# Altium schematic sheet comparators.SchDoc
size 508 x 241 mm; SheetNumber: 1; SheetTotal: 4
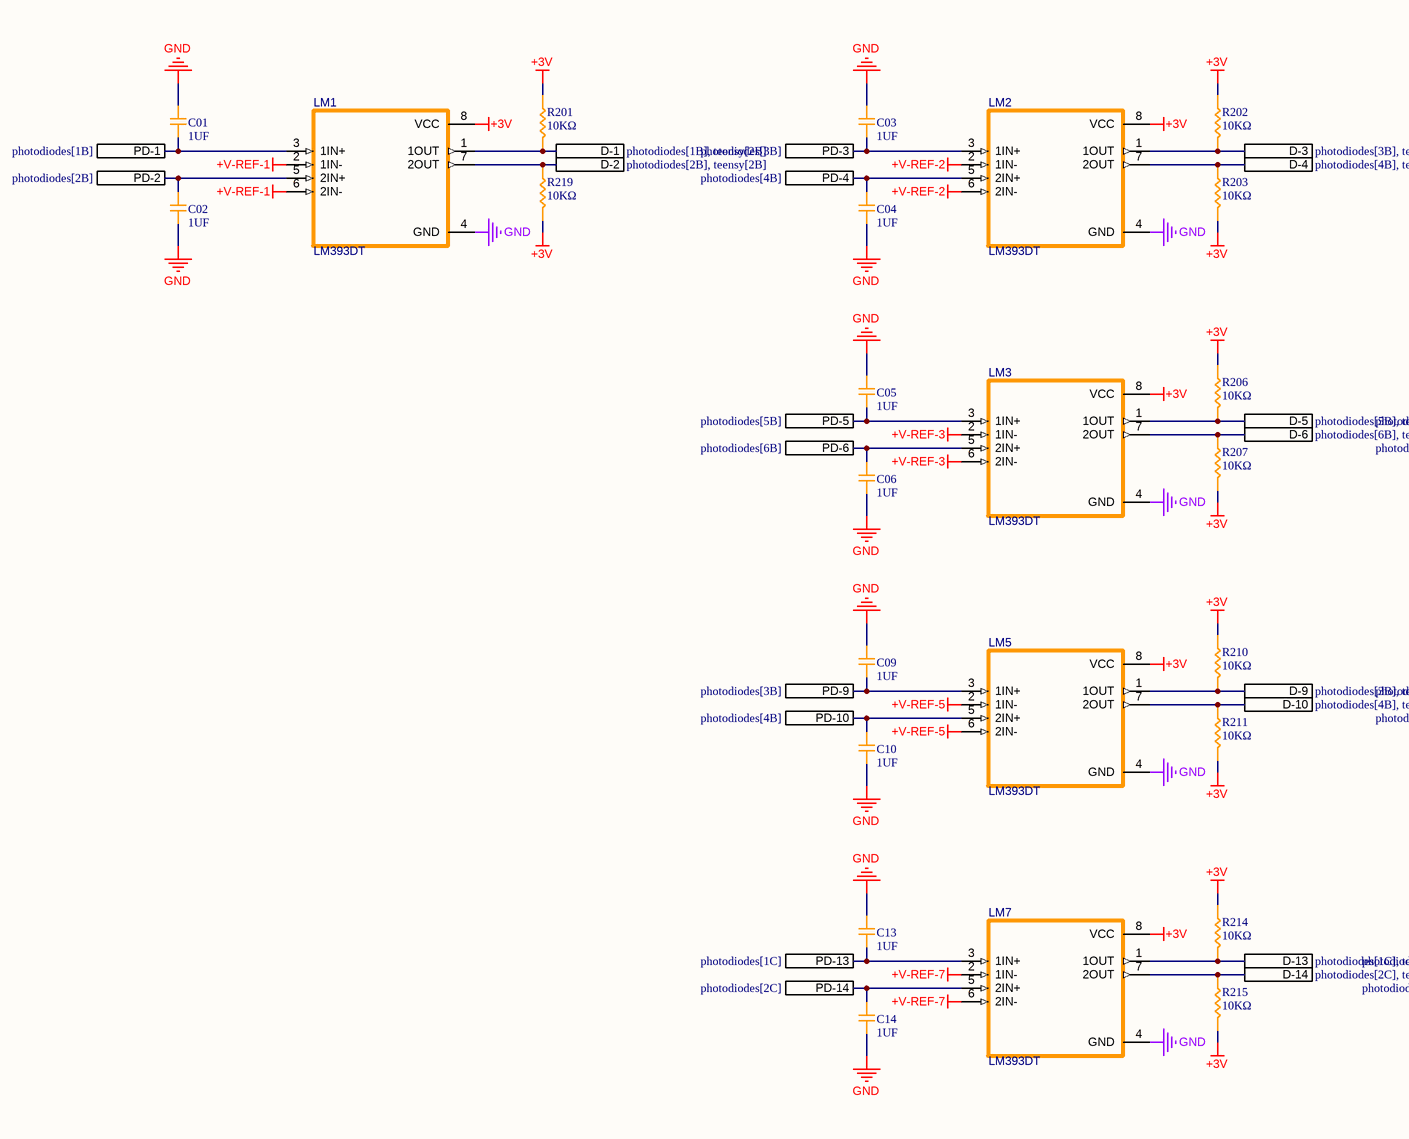
[diagram p0: comparators.SchDoc, left]
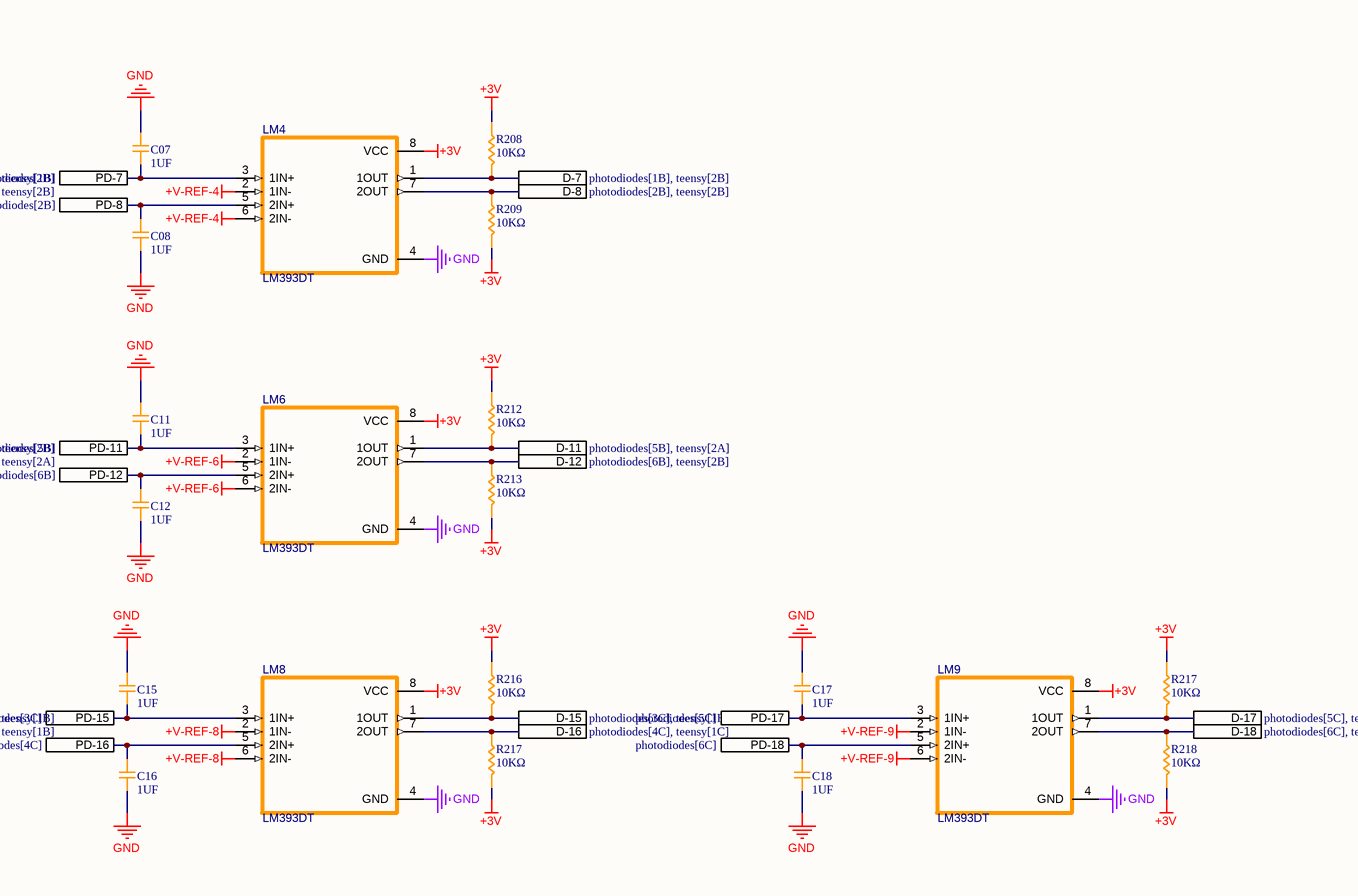
[diagram p1: comparators.SchDoc, right]

## Parts
(Parts that share a designator on the sheet are numbered #1, #2 ... from top to bottom, then left to right.)
C01  1UF  [CAP_0603]
C02  1UF  [CAP_0603]
C03  1UF  [CAP_0603]
C04  1UF  [CAP_0603]
C05  1UF  [CAP_0603]
C06  1UF  [CAP_0603]
C07  1UF  [CAP_0603]
C08  1UF  [CAP_0603]
C09  1UF  [CAP_0603]
C10  1UF  [CAP_0603]
C11  1UF  [CAP_0603]
C12  1UF  [CAP_0603]
C13  1UF  [CAP_0603]
C14  1UF  [CAP_0603]
C15  1UF  [CAP_0603]
C16  1UF  [CAP_0603]
C17  1UF  [CAP_0603]
C18  1UF  [CAP_0603]
LM1  LM393DT  [LM393DT]
LM2  LM393DT  [LM393DT]
LM3  LM393DT  [LM393DT]
LM4  LM393DT  [LM393DT]
LM5  LM393DT  [LM393DT]
LM6  LM393DT  [LM393DT]
LM7  LM393DT  [LM393DT]
LM8  LM393DT  [LM393DT]
LM9  LM393DT  [LM393DT]
R201  10KΩ  [RES_0603]
R202  10KΩ  [RES_0603]
R203  10KΩ  [RES_0603]
R206  10KΩ  [RES_0603]
R207  10KΩ  [RES_0603]
R208  10KΩ  [RES_0603]
R209  10KΩ  [RES_0603]
R210  10KΩ  [RES_0603]
R211  10KΩ  [RES_0603]
R212  10KΩ  [RES_0603]
R213  10KΩ  [RES_0603]
R214  10KΩ  [RES_0603]
R215  10KΩ  [RES_0603]
R216  10KΩ  [RES_0603]
R217#1  10KΩ  [RES_0603]
R217#2  10KΩ  [RES_0603]
R218  10KΩ  [RES_0603]
R219  10KΩ  [RES_0603]

## Ports
D-1 (see photodiodes[1B], teensy[2B]), D-2 (see photodiodes[2B], teensy[2B]), D-3 (see photodiodes[3B], teensy[2B]), D-4 (see photodiodes[4B], teensy[2B]), D-5 (see photodiodes[5B], teensy[2B]), D-6 (see photodiodes[6B], teensy[2B]), D-7 (see photodiodes[1B], teensy[2B]), D-8 (see photodiodes[2B], teensy[2B]), D-9 (see photodiodes[3B], teensy[2B]), D-10 (see photodiodes[4B], teensy[2A]), D-11 (see photodiodes[5B], teensy[2A]), D-12 (see photodiodes[6B], teensy[2B]), D-13 (see photodiodes[1C], teensy[1B]), D-14 (see photodiodes[2C], teensy[1B]), D-15 (see photodiodes[3C], teensy[1B]), D-16 (see photodiodes[4C], teensy[1C]), D-17 (see photodiodes[5C], teensy[2B]), D-18 (see photodiodes[6C], teensy[2C]), PD-1 (see photodiodes[1B]), PD-2 (see photodiodes[2B]), PD-3 (see photodiodes[3B]), PD-4 (see photodiodes[4B]), PD-5 (see photodiodes[5B]), PD-6 (see photodiodes[6B]), PD-7 (see photodiodes[1B]), PD-8 (see photodiodes[2B]), PD-9 (see photodiodes[3B]), PD-10 (see photodiodes[4B]), PD-11 (see photodiodes[5B]), PD-12 (see photodiodes[6B]), PD-13 (see photodiodes[1C]), PD-14 (see photodiodes[2C]), PD-15 (see photodiodes[3C]), PD-16 (see photodiodes[4C]), PD-17 (see photodiodes[5C]), PD-18 (see photodiodes[6C])

## Nets
+3V: LM1.8(VCC) LM2.8(VCC) LM3.8(VCC) LM4.8(VCC) LM5.8(VCC) LM6.8(VCC) LM7.8(VCC) LM8.8(VCC) LM9.8(VCC) R201.2 R202.2 R203.1 R206.2 R207.1 R208.2 R209.1 R210.2 R211.1 R212.2 R213.1 R214.2 R215.1 R216.2 R217#1.2 R217#2.1 R218.1 R219.1
+V-REF-1: LM1.2(1IN-) LM1.6(2IN-)
+V-REF-2: LM2.2(1IN-) LM2.6(2IN-)
+V-REF-3: LM3.2(1IN-) LM3.6(2IN-)
+V-REF-4: LM4.2(1IN-) LM4.6(2IN-)
+V-REF-5: LM5.2(1IN-) LM5.6(2IN-)
+V-REF-6: LM6.2(1IN-) LM6.6(2IN-)
+V-REF-7: LM7.2(1IN-) LM7.6(2IN-)
+V-REF-8: LM8.2(1IN-) LM8.6(2IN-)
+V-REF-9: LM9.2(1IN-) LM9.6(2IN-)
GND: C01.1 C02.2 C03.1 C04.1 C05.1 C06.2 C07.1 C08.2 C09.1 C10.2 C11.1 C12.2 C13.1 C14.2 C15.1 C16.2 C17.1 C18.2 LM1.4(GND) LM2.4(GND) LM3.4(GND) LM4.4(GND) LM5.4(GND) LM6.4(GND) LM7.4(GND) LM8.4(GND) LM9.4(GND)
D-1: LM1.1(1OUT) R201.1 ; port D-1
D-2: LM1.7(2OUT) R219.2 ; port D-2
D-3: LM2.1(1OUT) R202.1 ; port D-3
D-4: LM2.7(2OUT) R203.2 ; port D-4
D-5: LM3.1(1OUT) R206.1 ; port D-5
D-6: LM3.7(2OUT) R207.2 ; port D-6
D-7: LM4.1(1OUT) R208.1 ; port D-7
D-8: LM4.7(2OUT) R209.2 ; port D-8
D-9: LM5.1(1OUT) R210.1 ; port D-9
D-10: LM5.7(2OUT) R211.2 ; port D-10
D-11: LM6.1(1OUT) R212.1 ; port D-11
D-12: LM6.7(2OUT) R213.2 ; port D-12
D-13: LM7.1(1OUT) R214.1 ; port D-13
D-14: LM7.7(2OUT) R215.2 ; port D-14
D-15: LM8.1(1OUT) R216.1 ; port D-15
D-16: LM8.7(2OUT) R217#2.2 ; port D-16
D-17: LM9.1(1OUT) R217#1.1 ; port D-17
D-18: LM9.7(2OUT) R218.2 ; port D-18
PD-1: C01.2 LM1.3(1IN+) ; port PD-1
PD-2: C02.1 LM1.5(2IN+) ; port PD-2
PD-3: C03.2 LM2.3(1IN+) ; port PD-3
PD-4: C04.2 LM2.5(2IN+) ; port PD-4
PD-5: C05.2 LM3.3(1IN+) ; port PD-5
PD-6: C06.1 LM3.5(2IN+) ; port PD-6
PD-7: C07.2 LM4.3(1IN+) ; port PD-7
PD-8: C08.1 LM4.5(2IN+) ; port PD-8
PD-9: C09.2 LM5.3(1IN+) ; port PD-9
PD-10: C10.1 LM5.5(2IN+) ; port PD-10
PD-11: C11.2 LM6.3(1IN+) ; port PD-11
PD-12: C12.1 LM6.5(2IN+) ; port PD-12
PD-13: C13.2 LM7.3(1IN+) ; port PD-13
PD-14: C14.1 LM7.5(2IN+) ; port PD-14
PD-15: C15.2 LM8.3(1IN+) ; port PD-15
PD-16: C16.1 LM8.5(2IN+) ; port PD-16
PD-17: C17.2 LM9.3(1IN+) ; port PD-17
PD-18: C18.1 LM9.5(2IN+) ; port PD-18

## Library data of the parts
C01 C02 C03 C04 C05 C06 C07 C08 C09-C18 = CAP_0603: Capacitor SMD 0603 generic
R201-R203 R206-R216 R217#1 R217#2 R218 R219 = RES_0603: Resistor SMD 0603 generic